# EAGLE schematic flash (EAGLE 9.6.2)
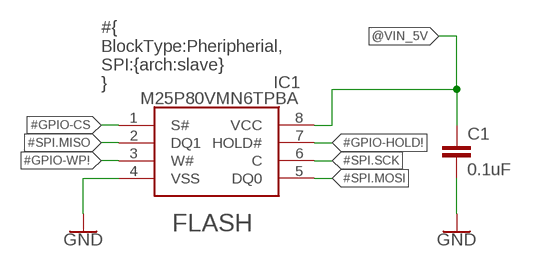
[diagram p0: schematic, sheet 1]

## Parts
C1  0.1uF  0.1UF-0603-25V-(+80/-20%)  [0603]
IC1  M25P80VMN6TPBA  [SOIC127P600X175-8N]

## Nets
#GPIO-CS: IC1.1(S#)
#GPIO-HOLD!: IC1.7(HOLD#)
#GPIO-WP!: IC1.3(W#)
#SPI.MISO: IC1.2(DQ1)
#SPI.MOSI: IC1.5(DQ0)
#SPI.SCK: IC1.6(C)
@VIN_5V: C1.1 IC1.8(VCC)
GND: C1.2 IC1.4(VSS)

## Notes on the sheet
- #{
  BlockType:Pheripherial,
  SPI:{arch:slave}
  }
- FLASH

## Library data of the parts
C1 = SparkFun-Capacitors:0.1UF: 0.1µF ceramic capacitors A capacitor is a passive two-terminal electrical component used to store electrical energy temporarily in an electric field.; PROD_ID: CAP-00810
IC1 = M25P80VMN6TPBA:M25P80VMN6TPBA: Micron M25P80 Serial Flash Embedded Memory Source: Datasheet <https://www.digchip.com/datasheets/parts/datasheet/3454/M25P80VMN6TPBA-pdf.php>; DESCRIPTION: Micron M25P80 Serial Flash Embedded Memory; HEIGHT: 1.75mm; MANUFACTURER_NAME: Micron; MANUFACTURER_PART_NUMBER: M25P80VMN6TPBA